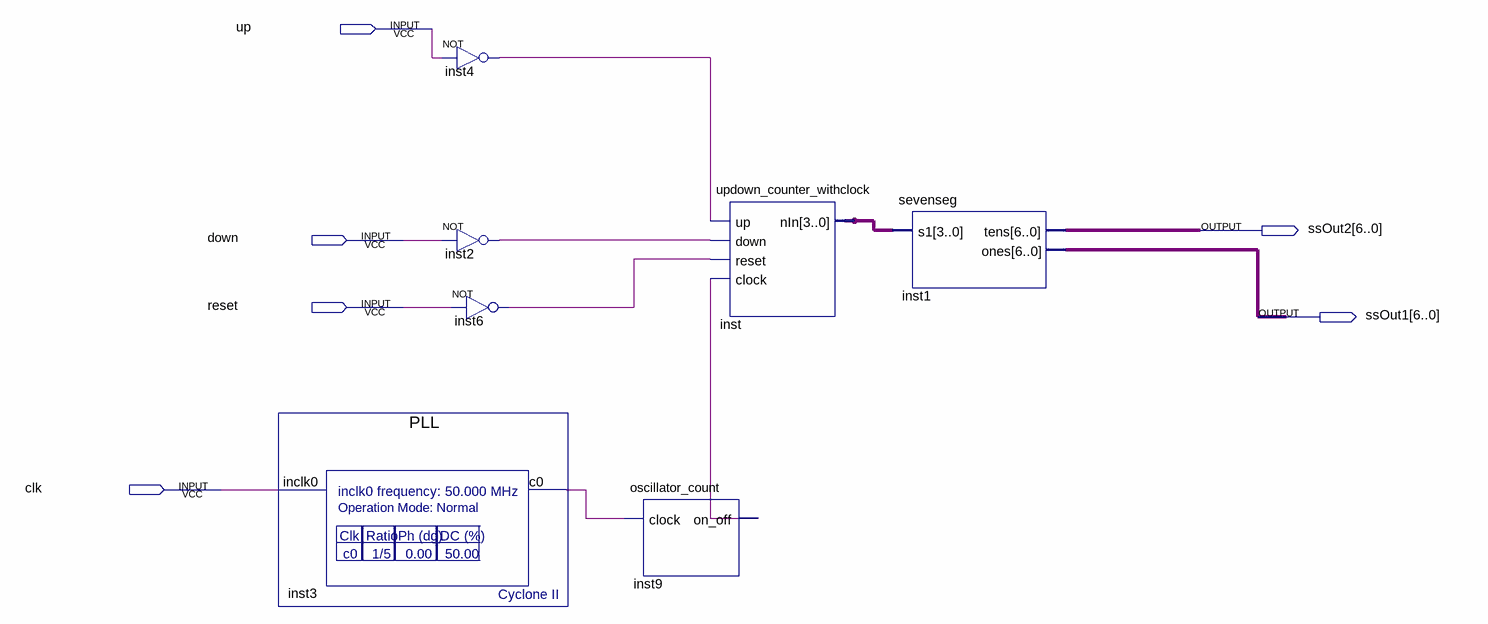
[diagram p0: schematic sheet]
// Quartus schematic BlockClock.bdf as structural Verilog: 7 symbols, 6 pins
module BlockClock (
  input  up,
  input  down,
  input  reset,
  input  clk,
  output [6:0] ssOut2,
  output [6:0] ssOut1
);

  wire inst2_out, inst3_c0, inst4_out, inst6_out, inst9_on_off;
  wire [3:0] inst_nin;

  PLL inst3 (.inclk0(clk), .c0(inst3_c0));
  not inst4 (inst4_out, up);
  not inst2 (inst2_out, down);
  not inst6 (inst6_out, reset);
  oscillator_count inst9 (.clock(inst3_c0), .on_off(inst9_on_off));
  updown_counter_withclock inst (
    .up(inst4_out), .down(inst2_out), .reset(inst6_out), .clock(inst9_on_off), .nIn(inst_nin));
  sevenseg inst1 (.s1(inst_nin), .tens(ssOut2), .ones(ssOut1));
endmodule
